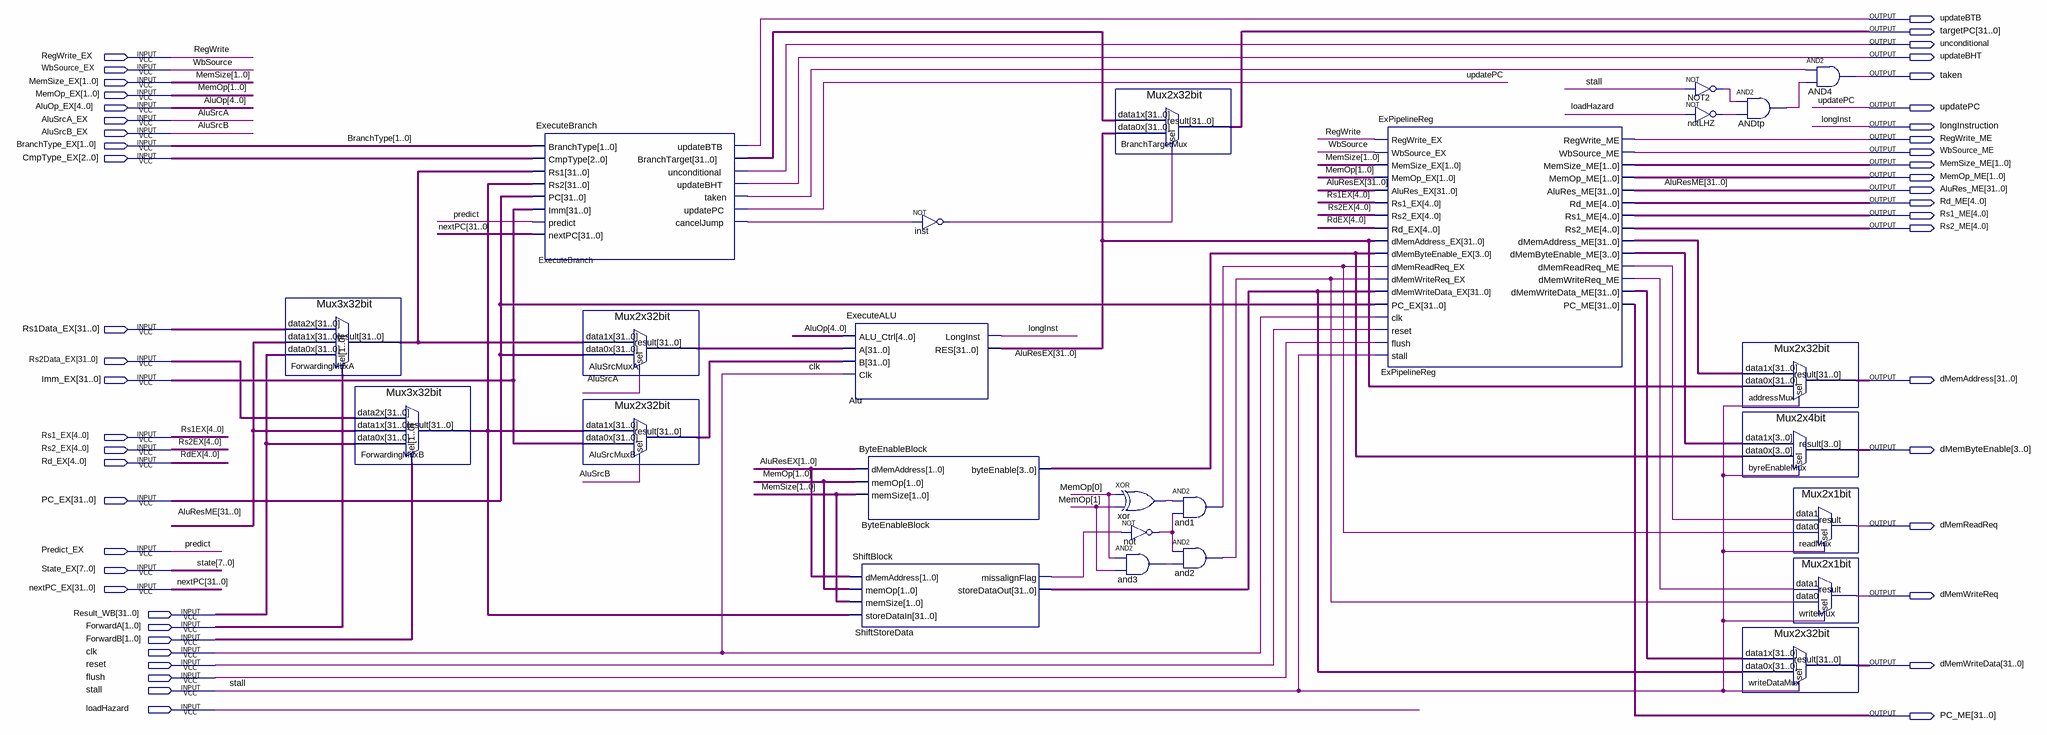
[diagram p0: schematic sheet]
// Quartus schematic Execute.bdf as structural Verilog: 25 symbols, 48 pins
module Execute (
  input  RegWrite_EX,
  input  WbSource_EX,
  input  [1:0] MemSize_EX,
  input  [1:0] MemOp_EX,
  input  [4:0] AluOp_EX,
  input  AluSrcA_EX,
  input  AluSrcB_EX,
  input  [1:0] BranchType_EX,
  input  [2:0] CmpType_EX,
  input  [31:0] Rs1Data_EX,
  input  [31:0] Rs2Data_EX,
  input  [31:0] Imm_EX,
  input  [4:0] Rs1_EX,
  input  [4:0] Rs2_EX,
  input  [4:0] Rd_EX,
  input  [31:0] PC_EX,
  input  Predict_EX,
  input  [7:0] State_EX,
  input  [31:0] nextPC_EX,
  input  [31:0] Result_WB,
  input  [1:0] ForwardA,
  input  [1:0] ForwardB,
  input  clk,
  input  reset,
  input  flush,
  input  stall,
  input  loadHazard,
  output updateBTB,
  output [31:0] targetPC,
  output unconditional,
  output updateBHT,
  output taken,
  output updatePC,
  output longInstruction,
  output RegWrite_ME,
  output WbSource_ME,
  output [1:0] MemSize_ME,
  output [1:0] MemOp_ME,
  output [31:0] AluRes_ME,
  output [4:0] Rd_ME,
  output [4:0] Rs1_ME,
  output [4:0] Rs2_ME,
  output [31:0] dMemAddress,
  output [3:0] dMemByteEnable,
  output dMemReadReq,
  output dMemWriteReq,
  output [31:0] dMemWriteData,
  output [31:0] PC_ME
);

  wire and1_out, and2_out, and3_out, ANDtp_out, ExecuteBranch_canceljump, ExecuteBranch_taken,
       ExPipelineReg_dmemreadreq_me, ExPipelineReg_dmemwritereq_me, inst_out, NOT2_out, not_out, notLHZ_out,
       ShiftStoreData_missalignflag, xor_out;
  wire [3:0] ByteEnableBlock_byteenable, ExPipelineReg_dmembyteenable_me;
  wire [31:0] AluResEX, AluSrcMuxA_result, AluSrcMuxB_result, ExecuteBranch_branchtarget,
       ExPipelineReg_dmemaddress_me, ExPipelineReg_dmemwritedata_me, ForwardingMuxA_result,
       ForwardingMuxB_result, ShiftStoreData_storedataout;

  Mux3x32bit ForwardingMuxA (
    .data2x(Rs1Data_EX), .data1x(AluRes_ME), .data0x(Result_WB), .sel(ForwardA),
    .result(ForwardingMuxA_result));
  Mux3x32bit ForwardingMuxB (
    .data2x(Rs2Data_EX), .data1x(AluRes_ME), .data0x(Result_WB), .sel(ForwardB),
    .result(ForwardingMuxB_result));
  ExecuteBranch ExecuteBranch (
    .BranchType(BranchType_EX), .CmpType(CmpType_EX), .Rs1(ForwardingMuxA_result),
    .Rs2(ForwardingMuxB_result), .PC(PC_EX), .Imm(Imm_EX), .predict(Predict_EX), .nextPC(nextPC_EX),
    .updateBTB(updateBTB), .BranchTarget(ExecuteBranch_branchtarget), .unconditional(unconditional),
    .updateBHT(updateBHT), .taken(ExecuteBranch_taken), .updatePC(updatePC),
    .cancelJump(ExecuteBranch_canceljump));
  Mux2x32bit AluSrcMuxA (.data1x(ForwardingMuxA_result), .data0x(PC_EX), .sel(AluSrcA_EX), .result(AluSrcMuxA_result));
  Mux2x32bit AluSrcMuxB (.data1x(ForwardingMuxB_result), .data0x(Imm_EX), .sel(AluSrcB_EX), .result(AluSrcMuxB_result));
  ExecuteALU Alu (
    .ALU_Ctrl(AluOp_EX), .A(AluSrcMuxA_result), .B(AluSrcMuxB_result), .Clk(clk), .LongInst(longInstruction),
    .RES(AluResEX));
  ByteEnableBlock ByteEnableBlock (
    .dMemAddress(AluResEX[1:0]), .memOp(MemOp_EX), .memSize(MemSize_EX),
    .byteEnable(ByteEnableBlock_byteenable));
  ShiftBlock ShiftStoreData (
    .dMemAddress(AluResEX[1:0]), .memOp(MemOp_EX), .memSize(MemSize_EX), .storeDataIn(ForwardingMuxB_result),
    .missalignFlag(ShiftStoreData_missalignflag), .storeDataOut(ShiftStoreData_storedataout));
  not inst (inst_out, ExecuteBranch_canceljump);
  Mux2x32bit BranchTargetMux (
    .data1x(ExecuteBranch_branchtarget), .data0x(AluResEX), .sel(inst_out), .result(targetPC));
  xor \xor  (xor_out, MemOp_EX[0], MemOp_EX[1]);
  not \not  (not_out, ShiftStoreData_missalignflag);
  and and3 (and3_out, MemOp_EX[0], MemOp_EX[1]);
  and and1 (and1_out, xor_out, not_out);
  and and2 (and2_out, not_out, and3_out);
  ExPipelineReg ExPipelineReg (
    .RegWrite_EX(RegWrite_EX), .WbSource_EX(WbSource_EX), .MemSize_EX(MemSize_EX), .MemOp_EX(MemOp_EX),
    .AluRes_EX(AluResEX), .Rs1_EX(Rs1_EX), .Rs2_EX(Rs2_EX), .Rd_EX(Rd_EX), .dMemAddress_EX(AluResEX),
    .dMemByteEnable_EX(ByteEnableBlock_byteenable), .dMemReadReq_EX(and1_out), .dMemWriteReq_EX(and2_out),
    .dMemWriteData_EX(ShiftStoreData_storedataout), .PC_EX(PC_EX), .clk(clk), .reset(reset), .flush(flush),
    .stall(stall), .RegWrite_ME(RegWrite_ME), .WbSource_ME(WbSource_ME), .MemSize_ME(MemSize_ME),
    .MemOp_ME(MemOp_ME), .AluRes_ME(AluRes_ME), .Rd_ME(Rd_ME), .Rs1_ME(Rs1_ME), .Rs2_ME(Rs2_ME),
    .dMemAddress_ME(ExPipelineReg_dmemaddress_me), .dMemByteEnable_ME(ExPipelineReg_dmembyteenable_me),
    .dMemReadReq_ME(ExPipelineReg_dmemreadreq_me), .dMemWriteReq_ME(ExPipelineReg_dmemwritereq_me),
    .dMemWriteData_ME(ExPipelineReg_dmemwritedata_me), .PC_ME(PC_ME));
  not NOT2 (NOT2_out, stall);
  not notLHZ (notLHZ_out, loadHazard);
  and ANDtp (ANDtp_out, NOT2_out, notLHZ_out);
  Mux2x32bit addressMux (.data1x(ExPipelineReg_dmemaddress_me), .data0x(AluResEX), .sel(stall), .result(dMemAddress));
  Mux2x4bit byreEnableMux (
    .data1x(ExPipelineReg_dmembyteenable_me), .data0x(ByteEnableBlock_byteenable), .sel(stall),
    .result(dMemByteEnable));
  Mux2x32bit writeDataMux (
    .data1x(ExPipelineReg_dmemwritedata_me), .data0x(ShiftStoreData_storedataout), .sel(stall),
    .result(dMemWriteData));
  and AND4 (taken, ExecuteBranch_taken, ANDtp_out);
  Mux2x1bit readMux (.data1(ExPipelineReg_dmemreadreq_me), .data0(and1_out), .sel(stall), .result(dMemReadReq));
  Mux2x1bit writeMux (.data1(ExPipelineReg_dmemwritereq_me), .data0(and2_out), .sel(stall), .result(dMemWriteReq));

  // Other names for the same wires on the sheet: AluOp[4:0] = AluOp_EX; AluResME[31:0] = AluRes_ME;
  //   AluSrcA = AluSrcA_EX; AluSrcB = AluSrcB_EX; BranchType[1:0] = BranchType_EX; longInst = longInstruction;
  //   MemOp[1:0] = MemOp_EX; MemSize[1:0] = MemSize_EX; nextPC[31:0] = nextPC_EX; predict = Predict_EX;
  //   RdEX[4:0] = Rd_EX; RegWrite = RegWrite_EX; Rs1EX[4:0] = Rs1_EX; Rs2EX[4:0] = Rs2_EX; state[7:0] = State_EX;
  //   WbSource = WbSource_EX
endmodule
